# Altium schematic sheet POWER.SchDoc
size A4; SheetNumber: 3; SheetTotal: 7
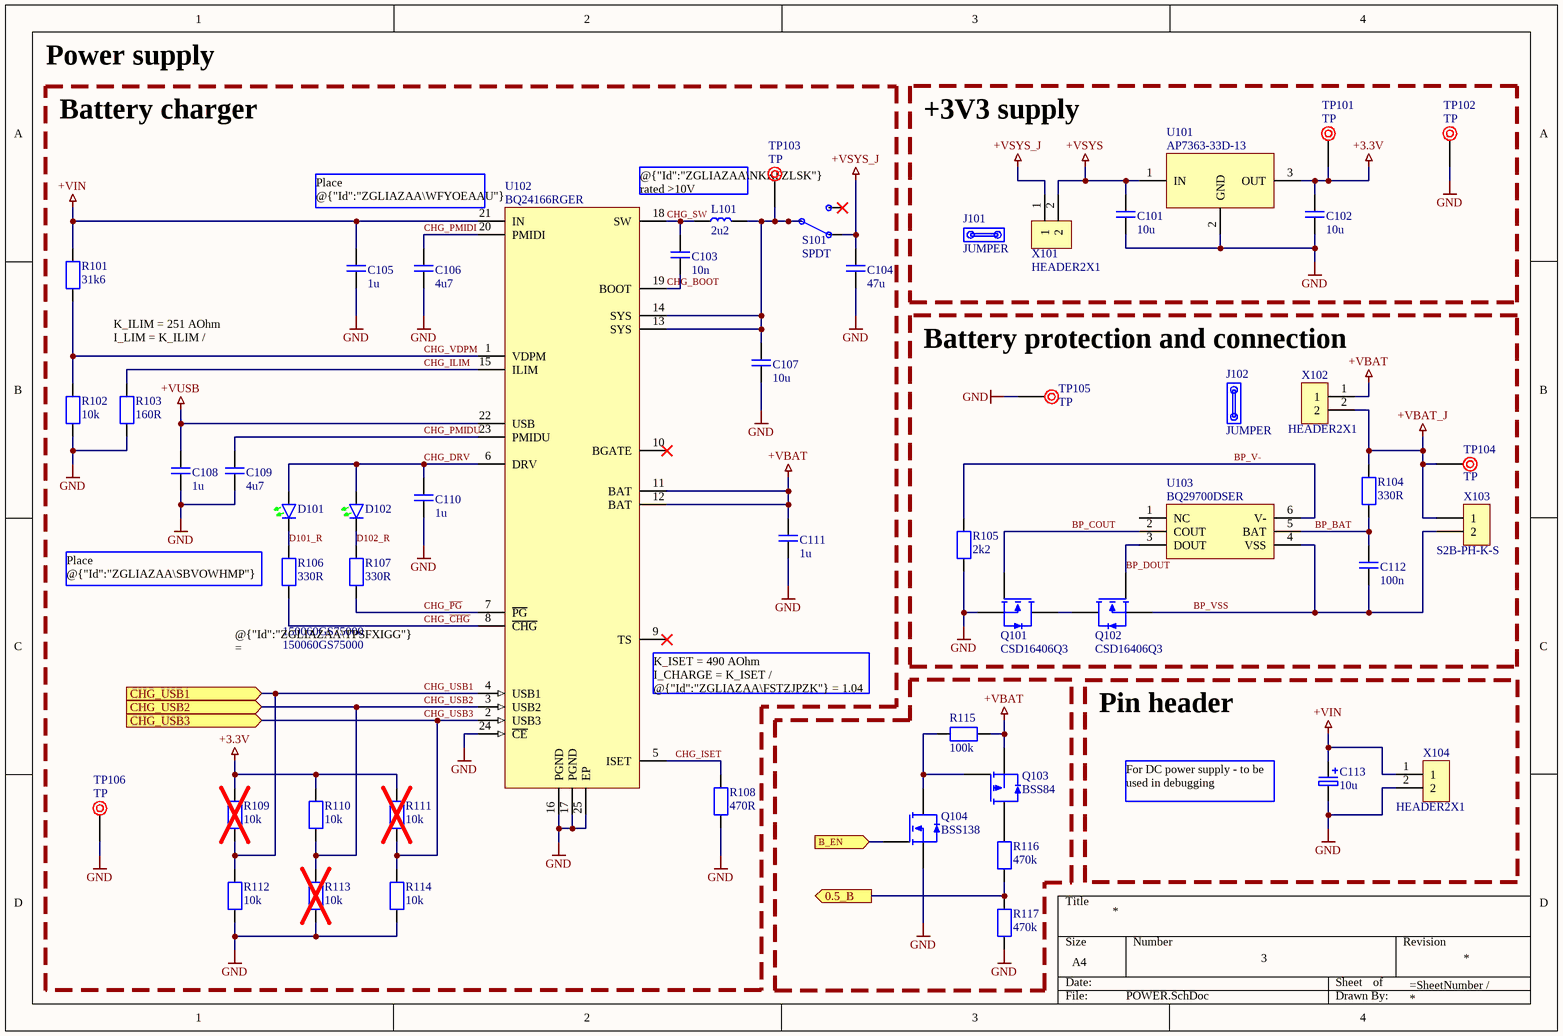
[diagram p0: POWER.SchDoc]

## Parts
C101  10u  [CAPC0603]
C102  10u  [CAPC0603]
C103  10n  [CAPC0603]
C104  47u  [CAPC0805]
C105  1u  [CAPC0603]
C106  4u7  [CAPC0603]
C107  10u  [CAPC0603]
C108  1u  [CAPC0603]
C109  4u7  [CAPC0603]
C110  1u  [CAPC0603]
C111  1u  [CAPC0603]
C112  100n  [CAPC0603]
C113  10u  [CAPCP1206]
D101  150060GS75000  [LED0603]
D102  150060GS75000  [LED0603]
J101  JUMPER  (mechanical)
J102  JUMPER  (mechanical)
L101  2u2  [INDM4145X18]
Q101  CSD16406Q3  [TRANS_CSD16406Q3]
Q102  CSD16406Q3  [TRANS_CSD16406Q3]
Q103  BSS84  [SOT190P240X290-3]
Q104  BSS138  [SOT190P240X290-3]
R101  31k6  [RESC0603]
R102  10k  [RESC0603]
R103  160R  [RESC0603]
R104  330R  [RESC0603]
R105  2k2  [RESC0603]
R106  330R  [RESC0603]
R107  330R  [RESC0603]
R108  470R  [RESC0603]
R109  10k  [RESC0603]
R110  10k  [RESC0603]
R111  10k  [RESC0603]
R112  10k  [RESC0603]
R113  10k  [RESC0603]
R114  10k  [RESC0603]
R115  100k  [RESC0603]
R116  470k  [RESC0603]
R117  470k  [RESC0603]
S101  SPDT  [SW_EG1247]
TP101  TP  [TESTPOINT]
TP102  TP  [TESTPOINT]
TP103  TP  [TESTPOINT]
TP104  TP  [TESTPOINT]
TP105  TP  [TESTPOINT]
TP106  TP  [TESTPOINT]
U101  AP7363-33D-13  [TO457X991X229-3]
U102  BQ24166RGER  [QFN50P410X410X100-24EP]
U103  BQ29700DSER  [WSON50P150X150X80-6]
X101  HEADER2X1  [HDRV2W64P254_2X1_508X254X1150]
X102  HEADER2X1  [HDRV2W64P254_2X1_508X254X1150]
X103  S2B-PH-K-S  [JST_S2B-PH-K-S]
X104  HEADER2X1  [HDRV2W64P254_2X1_508X254X1150]

## Blocks framed on the sheet
+3V3 supply: C101 C102 J101 TP101 TP102 U101 X101
Battery protection and connection: C112 J102 Q101 Q102 R104 R105 TP104 TP105 U103 X102 X103
Pin header: C113 X104

## Ports
0.5_B (out, see MCU[1B]), B_EN (in, see MCU[1B]), CHG_USB1 (in, see MCU[2B]), CHG_USB2 (in, see MCU[2B]), CHG_USB3 (in, see MCU[2B])

## Nets
+3.3V: C102.2 R109.1 R110.1 R111.1 TP101.1 U101.3(OUT)
+VBAT: C111.2 Q103.2(S) R115.1 U102.11(BAT) U102.12(BAT) X102.1
+VBAT_J: R104.2 TP104.1 X102.2 X103.1
+VIN: C105.2 C113.1 R101.2 U102.21(IN) X104.1
+VSYS: C101.2 U101.1(IN) X101.2
+VSYS_J: C104.2 S101.1 X101.1
+VUSB: C108.2 U102.22(USB)
GND: C101.1 C102.1 C104.1 C105.1 C106.1 C107.1 C108.1 C109.1 C110.1 C111.1 C113.2 Q101.1(S) Q104.2(S) R102.2 R103.2 R105.1 R108.1 R112.2 R113.2 R114.2 R117.2 TP102.1 TP105.1 TP106.1 U101.2(GND) U102.16(PGND) U102.17(PGND) U102.24(~{CE}) U102.25(EP) X104.2
0.5_B: R116.2 R117.1 ; port 0.5_B
B_EN: Q104.1(G) ; port B_EN
BP_BAT: C112.2 R104.1 U103.5(BAT)
BP_COUT: Q101.3(G) U103.2(COUT)
BP_DOUT: Q102.3(G) U103.3(DOUT)
BP_V-: R105.2 U103.6(V-)
BP_VSS: C112.1 Q102.1(S) U103.4(VSS) X103.2
CHG_BOOT: C103.1 U102.19(BOOT)
CHG_~{CHG}: R106.1 U102.8(~{CHG})
CHG_DRV: C110.2 D101.2 D102.2 U102.6(DRV)
CHG_ILIM: R103.1 U102.15(ILIM)
CHG_ISET: R108.2 U102.5(ISET)
CHG_~{PG}: R107.1 U102.7(~{PG})
CHG_PMIDI: C106.2 U102.20(PMIDI)
CHG_PMIDU: C109.2 U102.23(PMIDU)
CHG_SW: C103.2 L101.1 U102.18(SW)
CHG_USB1: R109.2 R112.1 U102.4(USB1) ; port CHG_USB1
CHG_USB2: R110.2 R113.1 U102.3(USB2) ; port CHG_USB2
CHG_USB3: R111.2 R114.1 U102.2(USB3) ; port CHG_USB3
CHG_VDPM: R101.1 R102.1 U102.1(VDPM)
D101_R: D101.1 R106.2
D102_R: D102.1 R107.2
NetC107_2: C107.2 L101.2 S101.2 TP103.1 U102.13(SYS) U102.14(SYS)
NetQ101_2: Q101.2(D) Q102.2(D)
NetQ103_1: Q103.1(G) Q104.3(D) R115.2
NetQ103_3: Q103.3(D) R116.1

Not connected (* = marked no-connect by the designer): S101 3*; U102 9(TS)* 10(BGATE)*; U103 1(NC)

## Notes on the sheet
- Power supply
- Battery charger
- (near U102) Place @{"Id":"ZGLIAZAA\WFYOEAAU"} and @{"Id":"ZGLIAZAA\EWRWHMYO"} as close as possible to charger IC
- @{"Id":"ZGLIAZAA\NKKFZLSK"} rated >10V
- K_ILIM = 251 AOhm
  I_LIM = K_ILIM / @{"Id":"ZGLIAZAA\ONCUCXZC"} = 1.57 A
- Place @{"Id":"ZGLIAZAA\SBVOWHMP"} and @{"Id":"ZGLIAZAA\CELJBMPW"} as close as possible to charger IC
- @{"Id":"ZGLIAZAA\TPSFXIGG"} =
  @{"Id":"ZGLIAZAA\WLQFVBKC"} =
- (near U102) K_ISET = 490 AOhm
  I_CHARGE = K_ISET / @{"Id":"ZGLIAZAA\FSTZJPZK"} = 1.04 A
- For DC power supply - to be used in debugging

## Library data of the parts
C101-C103 C105-C112 = CAPC0603: Ceramic capacitor, VAL?,  VOL?, DIEL?; Checked: Yes; MFR: ?; Supplier: Digi-Key; SPN: ?; MFRN: ?; LCSC Part Number: ?
  C101 C102 C107: Value: 10u
  C103: Value: 10n
  C105 C108 C110 C111: Value: 1u
  C106 C109: Value: 4u7
  C112: Value: 100n
C104 = CAPC0805: Ceramic capacitor, VAL?,  VOL?, DIEL?; Checked: Yes; Footprint: 0805; MFR: ?; Supplier: Mouser; SPN: ?; MFRN: ?; Value: 47u; LCSC Part Number: ?
C113 = CAPCP1206-10u-10: Tantalum capacitor, 10uF,  10V, 3.8Ohm; MFR: KEMET; MFRN: T491A106K010AT; SPN: 399-3684-2-ND; Checked: Yes; Supplier: Digi-Key; Value: 10u; LCSC Part Number: C1508940
D101 D102 = LTST-C194KGKT: LED Green, 2.1V, 20mA; MFR: Würth Elektronik; SPN: 732-4971-2-ND; Checked: Yes; Supplier: Digi-Key; MFRN: 150060GS75000; Value: Green; LCSC Part Number: C913102
J101 J102 = JUMPER: Open Top 3A 2.54mm P=2.54mm Shunts & Jumpers ROHS; MFR: Kycon, Inc.; MFRN: SX1100-A; SPN: 2092-SX1100-A-ND; Value: C5305; Checked: Yes; Supplier: Digi-Key; LCSC Part Number: C5305
L101 = INDM4145-2u2-20: Inductor 2.2uH, 4A, ±20%, 61mOhm; MFR: Bourns Inc.; MFRN: SRP4020TA-2R2M; SPN: SRP4020TA-2R2MTR-ND; Checked: Yes; Supplier: Digi-Key; Value: 2.2uH; LCSC Part Number: C2847469
Q101 Q102 = CSD16406Q3: MOSFET N-CH 25V 60A 8VSON; MFR: Texas Instruments; SPN: 296-24251-2-ND; Checked: Yes; Supplier: Digi-Key; MFRN: CSD16406Q3; Value: CSD16406Q3; LCSC Part Number: C2861720
Q103 = BSS84: MOSFET P-CH 50V 130mA SOT23-3; MFR: onsemi; SPN: BSS84TR-ND; Checked: Yes; Supplier: Digi-Key; MFRN: BSS84; Value: BSS84; LCSC Part Number: C266796
Q104 = BSS138: MOSFET N-CH 50V 220mA SOT23-3; MFR: onsemi; SPN: BSS138TR-ND; Checked: Yes; Supplier: Digi-Key; MFRN: BSS138; Value: BSS138; LCSC Part Number: C52895
R101-R117 = RES0603: Thick film resistor, VAL?, POW?; Checked: Yes; MFR: ?; Supplier: Digi-Key; SPN: ?; MFRN: ?; LCSC Part Number: ?
  R101: Value: 31k6
  R102 R109-R114: Value: 10k
  R103: Value: 160R
  R104 R106 R107: Value: 330R
  R105: Value: 2k2
  R108: Value: 470R
  R115: Value: 100k
  R116 R117: Value: 470k
S101 = SLIDE SW SPDT: Slide switch, SPDT, 30V, 200mA; MFR: E-Switch; MFRN: EG1247; SPN: EG1247-ND; Value: EG1247; Checked: Yes; Supplier: Digi-Key
TP101-TP106 = TESTPOINT: MFR: Keystone; MFRN: 5001; SPN: 36-5001-ND; Value: 5001; Checked: Yes; Supplier: Digi-Key; LCSC Part Number: C238122
U101 = IC REG LINEAR AP7363-33D-13: Linear LDO Voltage Regulator, 3.3V, 1.5A; MFR: Diodes Incorporated; SPN: AP7363-33D-13TR-ND; Checked: Yes; Supplier: Digi-Key; MFRN: AP7363-33D-13; Value: AP7363-33D-13; LCSC Part Number: C108723
U102 = IC BATT CHG LI-ION BQ24166: IC Battery Charger, Li-Ion, 1 Cell, 3.7V, 2.5A; MFR: Texas Instruments; SPN: 296-48490-2-ND; Checked: Yes; Supplier: Digi-Key; MFRN: BQ24166RGER; Value: BQ24166RGER; LCSC Part Number: C2758608
U103 = IC BATT PROT BQ29700DSER: Battery Protection IC Li-Ion 1Cell; MFR: Texas Instruments; SPN: 296-43985-2-ND; Checked: Yes; Supplier: Digi-Key; MFRN: BQ29700DSER; Value: BQ29700DSER; LCSC Part Number: C183096
X101 X102 = HEADER2X1: Pin Header 2x1, P2.54; MFR: Adam Tech; MFRN: PH1-02-UA; SPN: 2057-PH1-02-UA-ND; Value: X6521WV-2x01H-C60D30; Checked: Yes; Supplier: Digi-Key; LCSC Part Number: C2883961
X103 = JST S2B-PH-K-S: JST PH Connector 2POS R/A THT; MFR: JST Sales America Inc.; SPN: 455-1719-ND; Checked: Yes; Supplier: Digi-Key; MFRN: S2B-PH-K-S; Value: S2B-PH-K-S; LCSC Part Number: C173752
X104 = HEADER2X1: Pin Header 2x1, P2.54; MFR: Adam Tech; MFRN: PH1-02-UA; SPN: 2057-PH1-02-UA-ND; Checked: Yes; Supplier: Digi-Key; Value: HEADER2X1; LCSC Part Number: C2883961